# Altium schematic sheet Peripherals.SchDoc
size A3; SheetNumber: 7; SheetTotal: 29
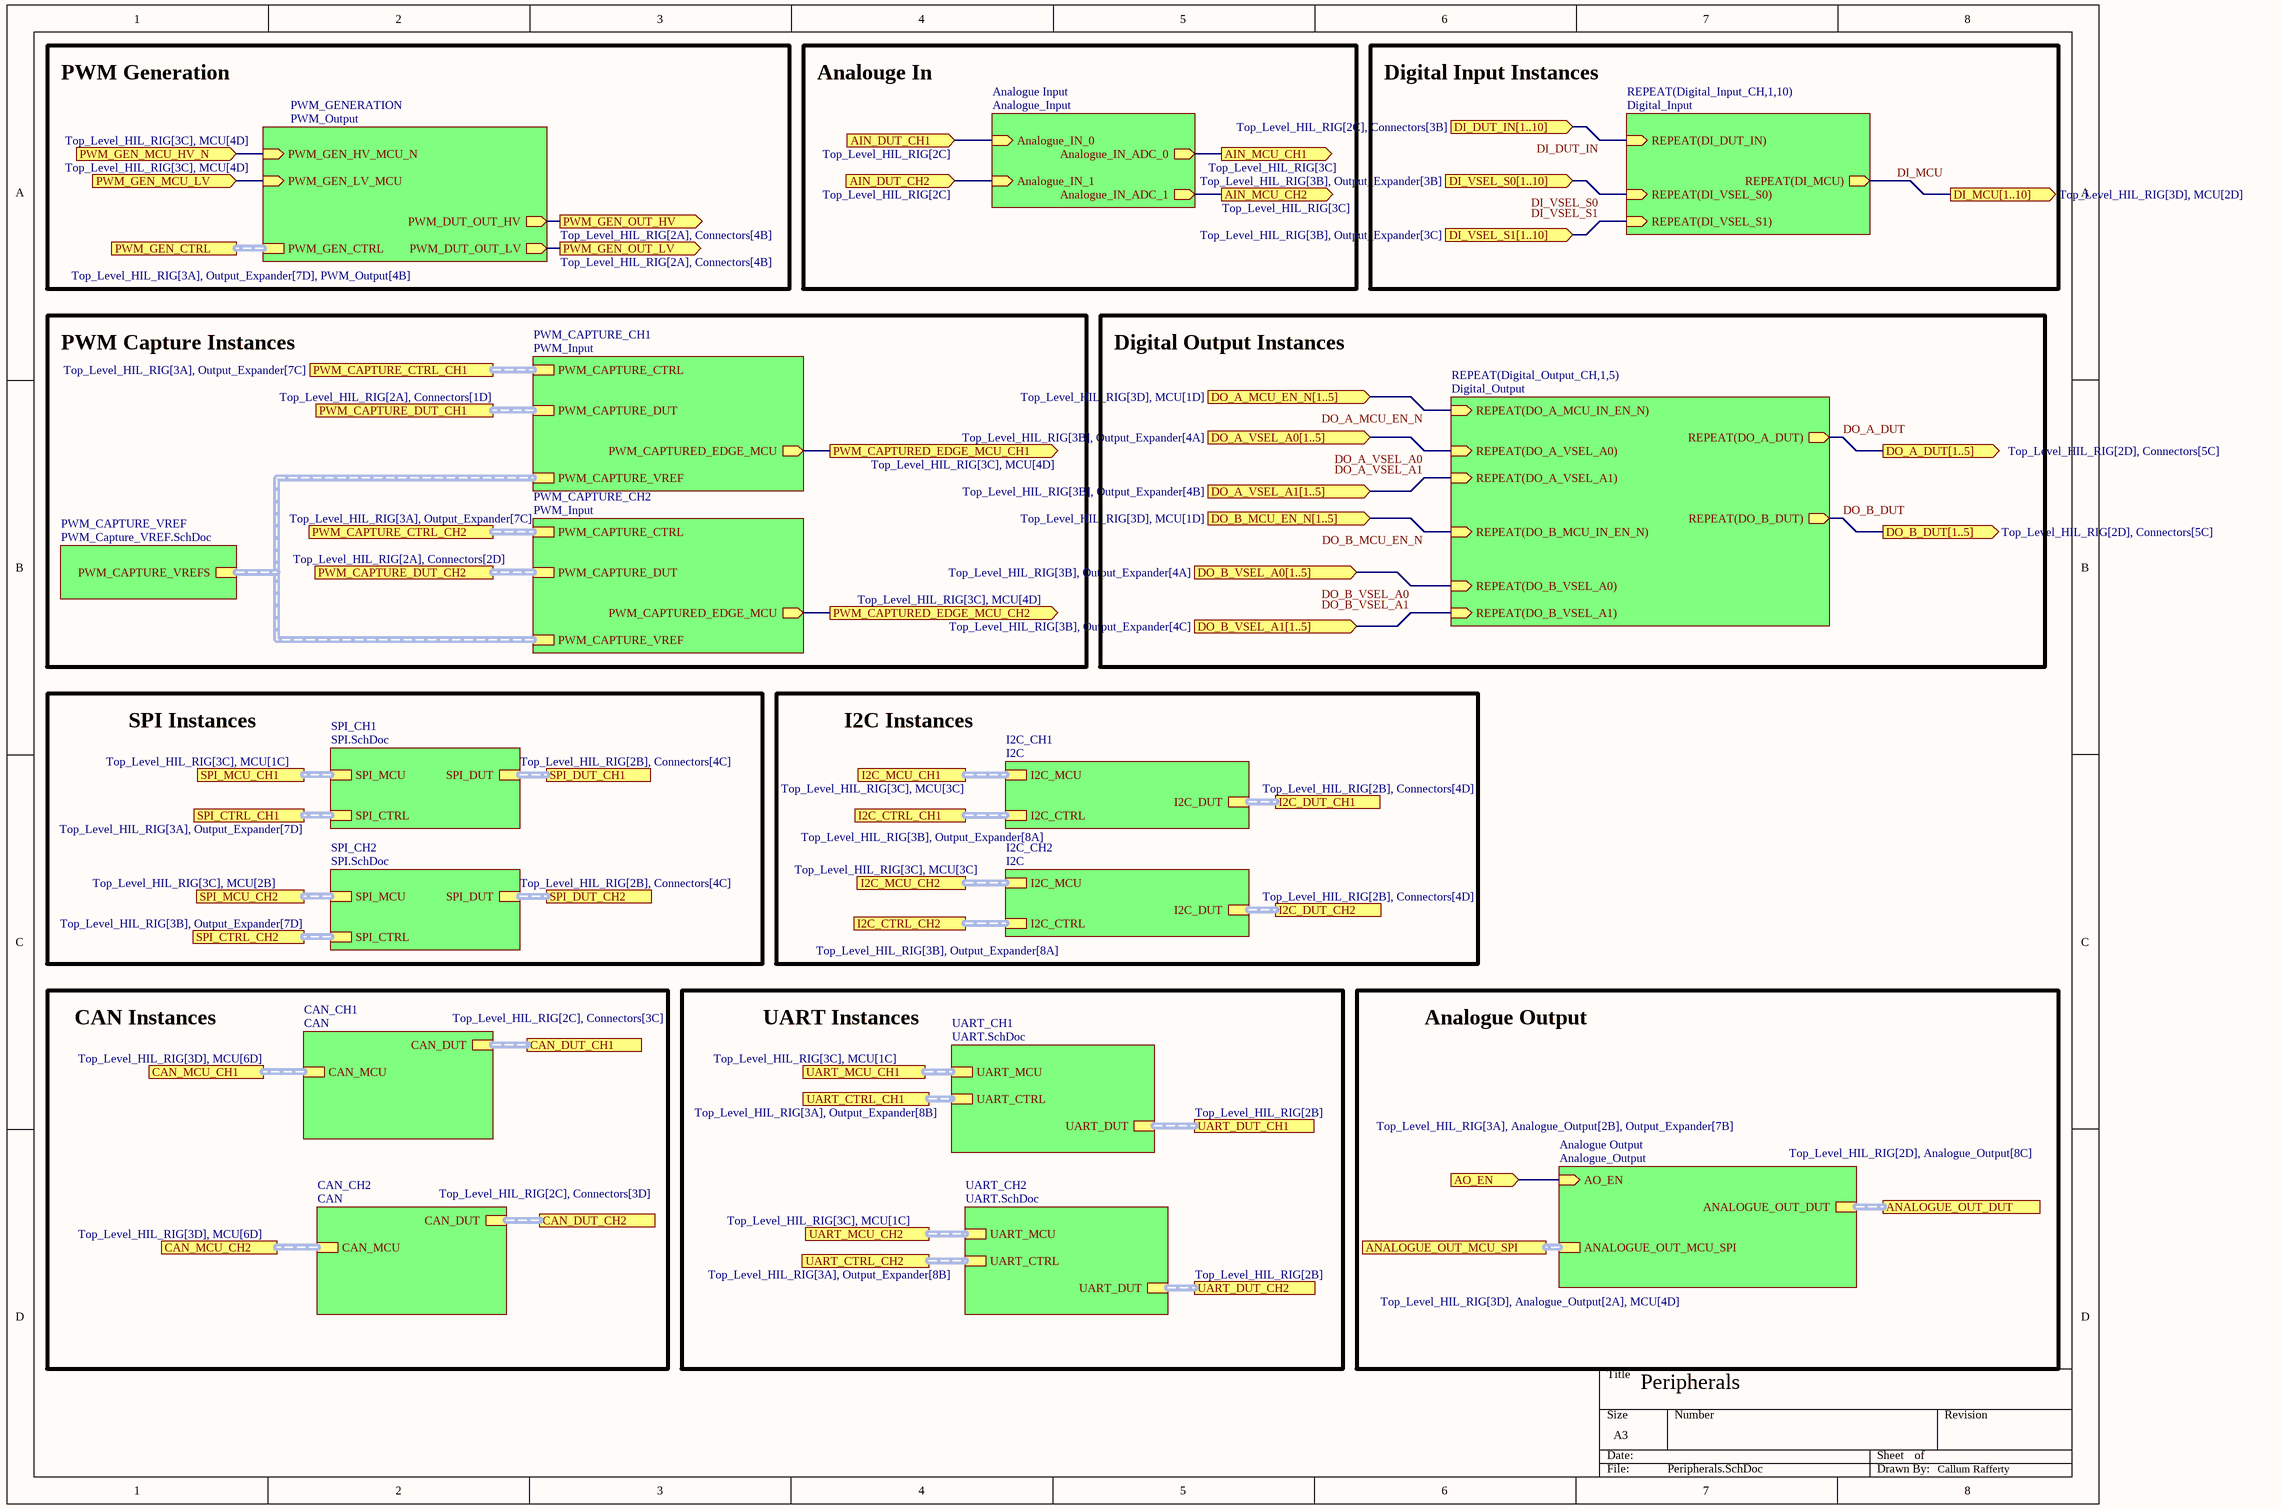
[diagram p0: Peripherals.SchDoc]

## Sub-sheets
Analogue Input = Analogue_Input: Analogue_IN_0 (in), Analogue_IN_1 (in), Analogue_IN_ADC_0 (out), Analogue_IN_ADC_1 (out)
Analogue Output = Analogue_Output: ANALOGUE_OUT_MCU_SPI (harness ANALOGUE_OUT_MCU_SIGNALS), ANALOGUE_OUT_DUT (harness ANALOUGE_OUT_DUT_SIGNALS), AO_EN (in)
CAN_CH1 = CAN: CAN_DUT (harness CAN_DIFFERENTIAL), CAN_MCU (harness CAN_TX_RX)
CAN_CH2 = CAN: CAN_DUT (harness CAN_DIFFERENTIAL), CAN_MCU (harness CAN_TX_RX)
I2C_CH1 = I2C: I2C_MCU (harness I2C_MCU_SIGNALS), I2C_DUT (harness I2C_DUT_SIGNALS\), I2C_CTRL (harness I2C_CTRL_SIGNALS)
I2C_CH2 = I2C: I2C_MCU (harness I2C_MCU_SIGNALS), I2C_DUT (harness I2C_DUT_SIGNALS\), I2C_CTRL (harness I2C_CTRL_SIGNALS)
PWM_CAPTURE_CH1 = PWM_Input: PWM_CAPTURED_EDGE_MCU (out), PWM_CAPTURE_CTRL (harness PWM_CAPTURE_CTRL_SIGNALS), PWM_CAPTURE_VREF (harness PWM_CAPTURE_VREF_SIGNALS), PWM_CAPTURE_DUT (harness PWM_CAPTURE_DUT_SIGNALS)
PWM_CAPTURE_CH2 = PWM_Input: PWM_CAPTURED_EDGE_MCU (out), PWM_CAPTURE_CTRL (harness PWM_CAPTURE_CTRL_SIGNALS), PWM_CAPTURE_VREF (harness PWM_CAPTURE_VREF_SIGNALS), PWM_CAPTURE_DUT (harness PWM_CAPTURE_DUT_SIGNALS)
PWM_CAPTURE_VREF = PWM_Capture_VREF.SchDoc: PWM_CAPTURE_VREFS (harness PWM_CAPTURE_VREF)
PWM_GENERATION = PWM_Output: PWM_GEN_HV_MCU_N (in), PWM_GEN_LV_MCU (in), PWM_DUT_OUT_HV (out), PWM_DUT_OUT_LV (out), PWM_GEN_CTRL (harness PWM_GEN_CTRL_SIGNALS)
REPEAT(Digital_Input_CH,1,10) = Digital_Input: REPEAT(DI_DUT_IN) (in), REPEAT(DI_MCU) (out), REPEAT(DI_VSEL_S0) (in), REPEAT(DI_VSEL_S1) (in)
REPEAT(Digital_Output_CH,1,5) = Digital_Output: REPEAT(DO_B_DUT) (out), REPEAT(DO_A_MCU_IN_EN_N) (in), REPEAT(DO_A_DUT) (out), REPEAT(DO_B_VSEL_A1) (in), REPEAT(DO_B_VSEL_A0) (in), REPEAT(DO_B_MCU_IN_EN_N) (in), REPEAT(DO_A_VSEL_A1) (in), REPEAT(DO_A_VSEL_A0) (in)
SPI_CH1 = SPI.SchDoc: SPI_MCU (harness SPI_MCU_SIGNALS), SPI_DUT (harness SPI_DUT_SIGNALS), SPI_CTRL (harness SPI_CTRL_SIGNALS)
SPI_CH2 = SPI.SchDoc: SPI_MCU (harness SPI_MCU_SIGNALS), SPI_DUT (harness SPI_DUT_SIGNALS), SPI_CTRL (harness SPI_CTRL_SIGNALS)
UART_CH1 = UART.SchDoc: UART_MCU (harness UART_MCU_SIGNALS), UART_DUT (harness UART_DUT_SIGNALS), UART_CTRL (harness UART_CTRL_SIGNALS)
UART_CH2 = UART.SchDoc: UART_MCU (harness UART_MCU_SIGNALS), UART_DUT (harness UART_DUT_SIGNALS), UART_CTRL (harness UART_CTRL_SIGNALS)

## Ports
AIN_DUT_CH1 (in, see Top_Level_HIL_RIG[2C]), AIN_DUT_CH2 (in, see Top_Level_HIL_RIG[2C]), AIN_MCU_CH1 (out, see Top_Level_HIL_RIG[3C]), AIN_MCU_CH2 (out, see Top_Level_HIL_RIG[3C]), ANALOGUE_OUT_DUT (see Top_Level_HIL_RIG[2D], Analogue_Output[8C]), ANALOGUE_OUT_MCU_SPI (see Top_Level_HIL_RIG[3D], Analogue_Output[2A], MCU[4D]), AO_EN (in, see Top_Level_HIL_RIG[3A], Analogue_Output[2B], Output_Expander[7B]), CAN_DUT_CH1 (harness CAN_DIFFERENTIAL, see Top_Level_HIL_RIG[2C], Connectors[3C]), CAN_DUT_CH2 (harness CAN_DIFFERENTIAL, see Top_Level_HIL_RIG[2C], Connectors[3D]), CAN_MCU_CH1 (harness CAN_TX_RX, see Top_Level_HIL_RIG[3D], MCU[6D]), CAN_MCU_CH2 (harness CAN_TX_RX, see Top_Level_HIL_RIG[3D], MCU[6D]), DI_DUT_IN[1..10] (in, see Top_Level_HIL_RIG[2C], Connectors[3B]), DI_MCU[1..10] (out, see Top_Level_HIL_RIG[3D], MCU[2D]), DI_VSEL_S0[1..10] (in, see Top_Level_HIL_RIG[3B], Output_Expander[3B]), DI_VSEL_S1[1..10] (in, see Top_Level_HIL_RIG[3B], Output_Expander[3C]), DO_A_DUT[1..5] (out, see Top_Level_HIL_RIG[2D], Connectors[5C]), DO_A_MCU_EN_N[1..5] (in, see Top_Level_HIL_RIG[3D], MCU[1D]), DO_A_VSEL_A0[1..5] (in, see Top_Level_HIL_RIG[3B], Output_Expander[4A]), DO_A_VSEL_A1[1..5] (in, see Top_Level_HIL_RIG[3B], Output_Expander[4B]), DO_B_DUT[1..5] (out, see Top_Level_HIL_RIG[2D], Connectors[5C]), DO_B_MCU_EN_N[1..5] (in, see Top_Level_HIL_RIG[3D], MCU[1D]), DO_B_VSEL_A0[1..5] (in, see Top_Level_HIL_RIG[3B], Output_Expander[4A]), DO_B_VSEL_A1[1..5] (in, see Top_Level_HIL_RIG[3B], Output_Expander[4C]), I2C_CTRL_CH1 (harness I2C_CTRL_SIGNALS, see Top_Level_HIL_RIG[3B], Output_Expander[8A]), I2C_CTRL_CH2 (harness I2C_CTRL_SIGNALS, see Top_Level_HIL_RIG[3B], Output_Expander[8A]), I2C_DUT_CH1 (harness I2C_DUT_SIGNALS, see Top_Level_HIL_RIG[2B], Connectors[4D]), I2C_DUT_CH2 (harness I2C_DUT_SIGNALS, see Top_Level_HIL_RIG[2B], Connectors[4D]), I2C_MCU_CH1 (harness I2C_MCU_SIGNALS, see Top_Level_HIL_RIG[3C], MCU[3C]), I2C_MCU_CH2 (harness I2C_MCU_SIGNALS, see Top_Level_HIL_RIG[3C], MCU[3C]), PWM_CAPTURE_CTRL_CH1 (harness PWM_CAPTURE_CTRL_SIGNALS, see Top_Level_HIL_RIG[3A], Output_Expander[7C]), PWM_CAPTURE_CTRL_CH2 (harness PWM_CAPTURE_CTRL_SIGNALS, see Top_Level_HIL_RIG[3A], Output_Expander[7C]), PWM_CAPTURE_DUT_CH1 (harness PWM_CAPTURE_DUT_SIGNALS, see Top_Level_HIL_RIG[2A], Connectors[1D]), PWM_CAPTURE_DUT_CH2 (harness PWM_CAPTURE_DUT_SIGNALS, see Top_Level_HIL_RIG[2A], Connectors[2D]), PWM_CAPTURED_EDGE_MCU_CH1 (out, see Top_Level_HIL_RIG[3C], MCU[4D]), PWM_CAPTURED_EDGE_MCU_CH2 (out, see Top_Level_HIL_RIG[3C], MCU[4D]), PWM_GEN_CTRL (harness PWM_GEN_CTRL_SIGNALS, see Top_Level_HIL_RIG[3A], Output_Expander[7D], PWM_Output[4B]), PWM_GEN_MCU_HV_N (in, see Top_Level_HIL_RIG[3C], MCU[4D]), PWM_GEN_MCU_LV (in, see Top_Level_HIL_RIG[3C], MCU[4D]), PWM_GEN_OUT_HV (out, see Top_Level_HIL_RIG[2A], Connectors[4B]), PWM_GEN_OUT_LV (out, see Top_Level_HIL_RIG[2A], Connectors[4B]), SPI_CTRL_CH1 (harness SPI_CTRL_SIGNALS, see Top_Level_HIL_RIG[3A], Output_Expander[7D]), SPI_CTRL_CH2 (harness SPI_CTRL_SIGNALS, see Top_Level_HIL_RIG[3B], Output_Expander[7D]), SPI_DUT_CH1 (harness SPI_DUT_SIGNALS, see Top_Level_HIL_RIG[2B], Connectors[4C]), SPI_DUT_CH2 (harness SPI_DUT_SIGNALS, see Top_Level_HIL_RIG[2B], Connectors[4C]), SPI_MCU_CH1 (harness SPI_MCU_SIGNALS, see Top_Level_HIL_RIG[3C], MCU[1C]), SPI_MCU_CH2 (harness SPI_MCU_SIGNALS, see Top_Level_HIL_RIG[3C], MCU[2B]), UART_CTRL_CH1 (harness UART_CTRL_SIGNALS, see Top_Level_HIL_RIG[3A], Output_Expander[8B]), UART_CTRL_CH2 (harness UART_CTRL_SIGNALS, see Top_Level_HIL_RIG[3A], Output_Expander[8B]), UART_DUT_CH1 (harness UART_DUT_SIGNALS, see Top_Level_HIL_RIG[2B]), UART_DUT_CH2 (harness UART_DUT_SIGNALS, see Top_Level_HIL_RIG[2B]), UART_MCU_CH1 (harness UART_MCU_SIGNALS, see Top_Level_HIL_RIG[3C], MCU[1C]), UART_MCU_CH2 (harness UART_MCU_SIGNALS, see Top_Level_HIL_RIG[3C], MCU[1C])

## Nets
AIN_DUT_CH1: port AIN_DUT_CH1, sheet Analogue Input/Analogue_IN_0
AIN_DUT_CH2: port AIN_DUT_CH2, sheet Analogue Input/Analogue_IN_1
AIN_MCU_CH1: port AIN_MCU_CH1, sheet Analogue Input/Analogue_IN_ADC_0
AIN_MCU_CH2: port AIN_MCU_CH2, sheet Analogue Input/Analogue_IN_ADC_1
AO_EN: port AO_EN, sheet Analogue Output/AO_EN
DI_DUT_IN: sheet REPEAT(Digital_Input_CH,1,10)/REPEAT(DI_DUT_IN)
DI_MCU: sheet REPEAT(Digital_Input_CH,1,10)/REPEAT(DI_MCU)
DI_VSEL_S0: sheet REPEAT(Digital_Input_CH,1,10)/REPEAT(DI_VSEL_S0)
DI_VSEL_S1: sheet REPEAT(Digital_Input_CH,1,10)/REPEAT(DI_VSEL_S1)
DO_A_DUT: sheet REPEAT(Digital_Output_CH,1,5)/REPEAT(DO_A_DUT)
DO_A_MCU_EN_N: sheet REPEAT(Digital_Output_CH,1,5)/REPEAT(DO_A_MCU_IN_EN_N)
DO_A_VSEL_A0: sheet REPEAT(Digital_Output_CH,1,5)/REPEAT(DO_A_VSEL_A0)
DO_A_VSEL_A1: sheet REPEAT(Digital_Output_CH,1,5)/REPEAT(DO_A_VSEL_A1)
DO_B_DUT: sheet REPEAT(Digital_Output_CH,1,5)/REPEAT(DO_B_DUT)
DO_B_MCU_EN_N: sheet REPEAT(Digital_Output_CH,1,5)/REPEAT(DO_B_MCU_IN_EN_N)
DO_B_VSEL_A0: sheet REPEAT(Digital_Output_CH,1,5)/REPEAT(DO_B_VSEL_A0)
DO_B_VSEL_A1: sheet REPEAT(Digital_Output_CH,1,5)/REPEAT(DO_B_VSEL_A1)
PWM_CAPTURED_EDGE_MCU_CH1: port PWM_CAPTURED_EDGE_MCU_CH1, sheet PWM_CAPTURE_CH1/PWM_CAPTURED_EDGE_MCU
PWM_CAPTURED_EDGE_MCU_CH2: port PWM_CAPTURED_EDGE_MCU_CH2, sheet PWM_CAPTURE_CH2/PWM_CAPTURED_EDGE_MCU
PWM_GEN_MCU_HV_N: port PWM_GEN_MCU_HV_N, sheet PWM_GENERATION/PWM_GEN_HV_MCU_N
PWM_GEN_MCU_LV: port PWM_GEN_MCU_LV, sheet PWM_GENERATION/PWM_GEN_LV_MCU
PWM_GEN_OUT_HV: port PWM_GEN_OUT_HV, sheet PWM_GENERATION/PWM_DUT_OUT_HV
PWM_GEN_OUT_LV: port PWM_GEN_OUT_LV, sheet PWM_GENERATION/PWM_DUT_OUT_LV

## Buses and harness runs
harness port ANALOGUE_OUT_DUT = sheet Analogue Output/ANALOGUE_OUT_DUT
harness port ANALOGUE_OUT_MCU_SPI = sheet Analogue Output/ANALOGUE_OUT_MCU_SPI
harness port CAN_DUT_CH1 = sheet CAN_CH1/CAN_DUT
harness port CAN_DUT_CH2 = sheet CAN_CH2/CAN_DUT
harness port CAN_MCU_CH1 = sheet CAN_CH1/CAN_MCU
harness port CAN_MCU_CH2 = sheet CAN_CH2/CAN_MCU
harness port I2C_CTRL_CH1 = sheet I2C_CH1/I2C_CTRL
harness port I2C_CTRL_CH2 = sheet I2C_CH2/I2C_CTRL
harness port I2C_DUT_CH1 = sheet I2C_CH1/I2C_DUT
harness port I2C_DUT_CH2 = sheet I2C_CH2/I2C_DUT
harness port I2C_MCU_CH1 = sheet I2C_CH1/I2C_MCU
harness port I2C_MCU_CH2 = sheet I2C_CH2/I2C_MCU
harness port PWM_CAPTURE_CTRL_CH1 = sheet PWM_CAPTURE_CH1/PWM_CAPTURE_CTRL
harness port PWM_CAPTURE_CTRL_CH2 = sheet PWM_CAPTURE_CH2/PWM_CAPTURE_CTRL
harness port PWM_CAPTURE_DUT_CH1 = sheet PWM_CAPTURE_CH1/PWM_CAPTURE_DUT
harness port PWM_CAPTURE_DUT_CH2 = sheet PWM_CAPTURE_CH2/PWM_CAPTURE_DUT
harness port PWM_GEN_CTRL = sheet PWM_GENERATION/PWM_GEN_CTRL
harness port SPI_CTRL_CH1 = sheet SPI_CH1/SPI_CTRL
harness port SPI_CTRL_CH2 = sheet SPI_CH2/SPI_CTRL
harness port SPI_DUT_CH1 = sheet SPI_CH1/SPI_DUT
harness port SPI_DUT_CH2 = sheet SPI_CH2/SPI_DUT
harness port SPI_MCU_CH1 = sheet SPI_CH1/SPI_MCU
harness port SPI_MCU_CH2 = sheet SPI_CH2/SPI_MCU
harness port UART_CTRL_CH1 = sheet UART_CH1/UART_CTRL
harness port UART_CTRL_CH2 = sheet UART_CH2/UART_CTRL
harness port UART_DUT_CH1 = sheet UART_CH1/UART_DUT
harness port UART_DUT_CH2 = sheet UART_CH2/UART_DUT
harness port UART_MCU_CH1 = sheet UART_CH1/UART_MCU
harness port UART_MCU_CH2 = sheet UART_CH2/UART_MCU
harness sheet PWM_CAPTURE_CH1/PWM_CAPTURE_VREF = sheet PWM_CAPTURE_CH2/PWM_CAPTURE_VREF = sheet PWM_CAPTURE_VREF/PWM_CAPTURE_VREFS

## Notes on the sheet
- PWM Generation
- Analouge In
- Digital Input Instances
- PWM Capture Instances
- Digital Output Instances
- SPI Instances
- I2C Instances
- CAN Instances
- UART Instances
- Analogue Output
- Peripherals
- Callum Rafferty